# Altium schematic sheet power_main.SchDoc
size A4
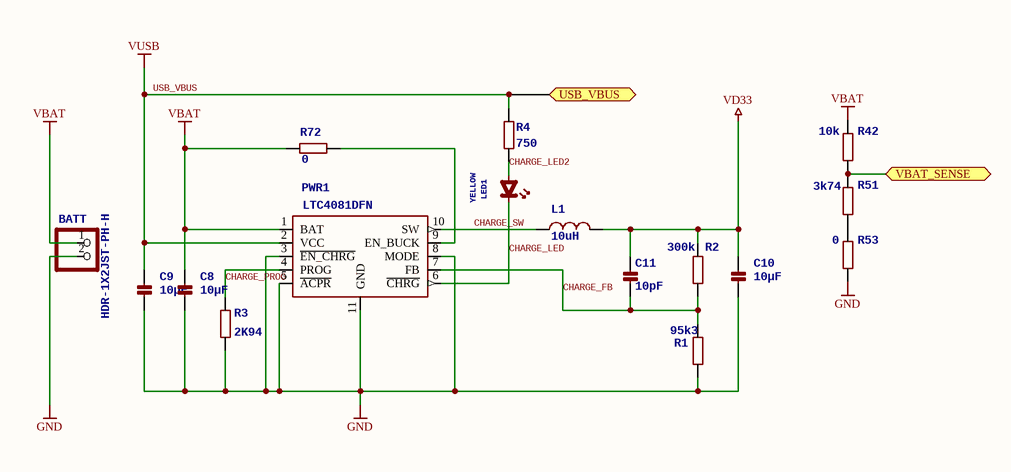
[diagram p0: power_main.SchDoc]

## Parts
BATT  HDR-1X2JST-PH-H  [S2B-PH-SM4-TB]
C8  10µF  [0603]
C9  10µF  [0603]
C10  10µF  [0603]
C11  10pF  [0402]
L1  10uH  [INDUCTOR_40X40]
LED1  YELLOW  [0402_POLAR]
PWR1  LTC4081DFN  [LTC4080_DFN]
R1  95k3  [0402]
R2  300k  [0402]
R3  2K94  [0402]
R4  750  [0402]
R42  10k  [0402]
R51  3k74  [0402]
R53  0  [0402]
R72  0  [0805 v3]

## Ports
USB_VBUS, VBAT_SENSE

## Nets
GND: BATT.2 C8.2(P2) C9.2(P2) C10.2(P2) PWR1.3(~{EN_CHRG}) PWR1.5(~{ACPR}) PWR1.8(MODE) PWR1.11(GND) R1.1 R3.1 R53.1
USB_VBUS: C9.1(P1) PWR1.2(VCC) R4.2 ; port USB_VBUS  [also labelled VUSB]
VBAT: BATT.1 C8.1(P1) PWR1.1(BAT) R42.2 R72.2
VD33: C10.1(P1) C11.1 L1.2 R2.2
CHARGE_FB: C11.2 PWR1.7(FB) R1.2 R2.1
CHARGE_LED: LED1.K(CATHODE) PWR1.6(~{CHRG})
CHARGE_LED2: LED1.A(ANODE) R4.1
CHARGE_PROG: PWR1.4(PROG) R3.2
CHARGE_SW: L1.1 PWR1.10(SW)
VBAT_SENSE: R42.1 R51.2 ; port VBAT_SENSE
NetPWR1_9: PWR1.9(EN_BUCK) R72.1
NetR51_1: R51.1 R53.2

## Library data of the parts
BATT = HEADER-1X2JST-PH-H: LI-Poly battery connector; SMD: Yes
C8-C10 = CAP_CERAMIC0603: Ceramic Capacitor; SMD: Yes
C11 = CAP_CERAMIC0402: Ceramic Capacitor; SMD: Yes
L1 = INDUCTOR40X40MM: Generic inductor; SMD: Yes
LED1 = LED0402: LED common; SMD: Yes
PWR1 = LTC4080DFN: Linear Technology Li-Ion battery charger and buck regulator; SMD: Yes
R1-R4 R42 R51 R53 R72 = R-EU_0402: RESISTOR; SMD: Yes